# EasyEDA schematic SCH_pcb_tfg_v1.1a_conHDR_2021-07-26.json
TITLE: pcb_tfg_v1.1a_conHDR; REV: v1.1a; Date: 2021-04-10; Sheet: 1/1; Drawn By: Lucia Francoso
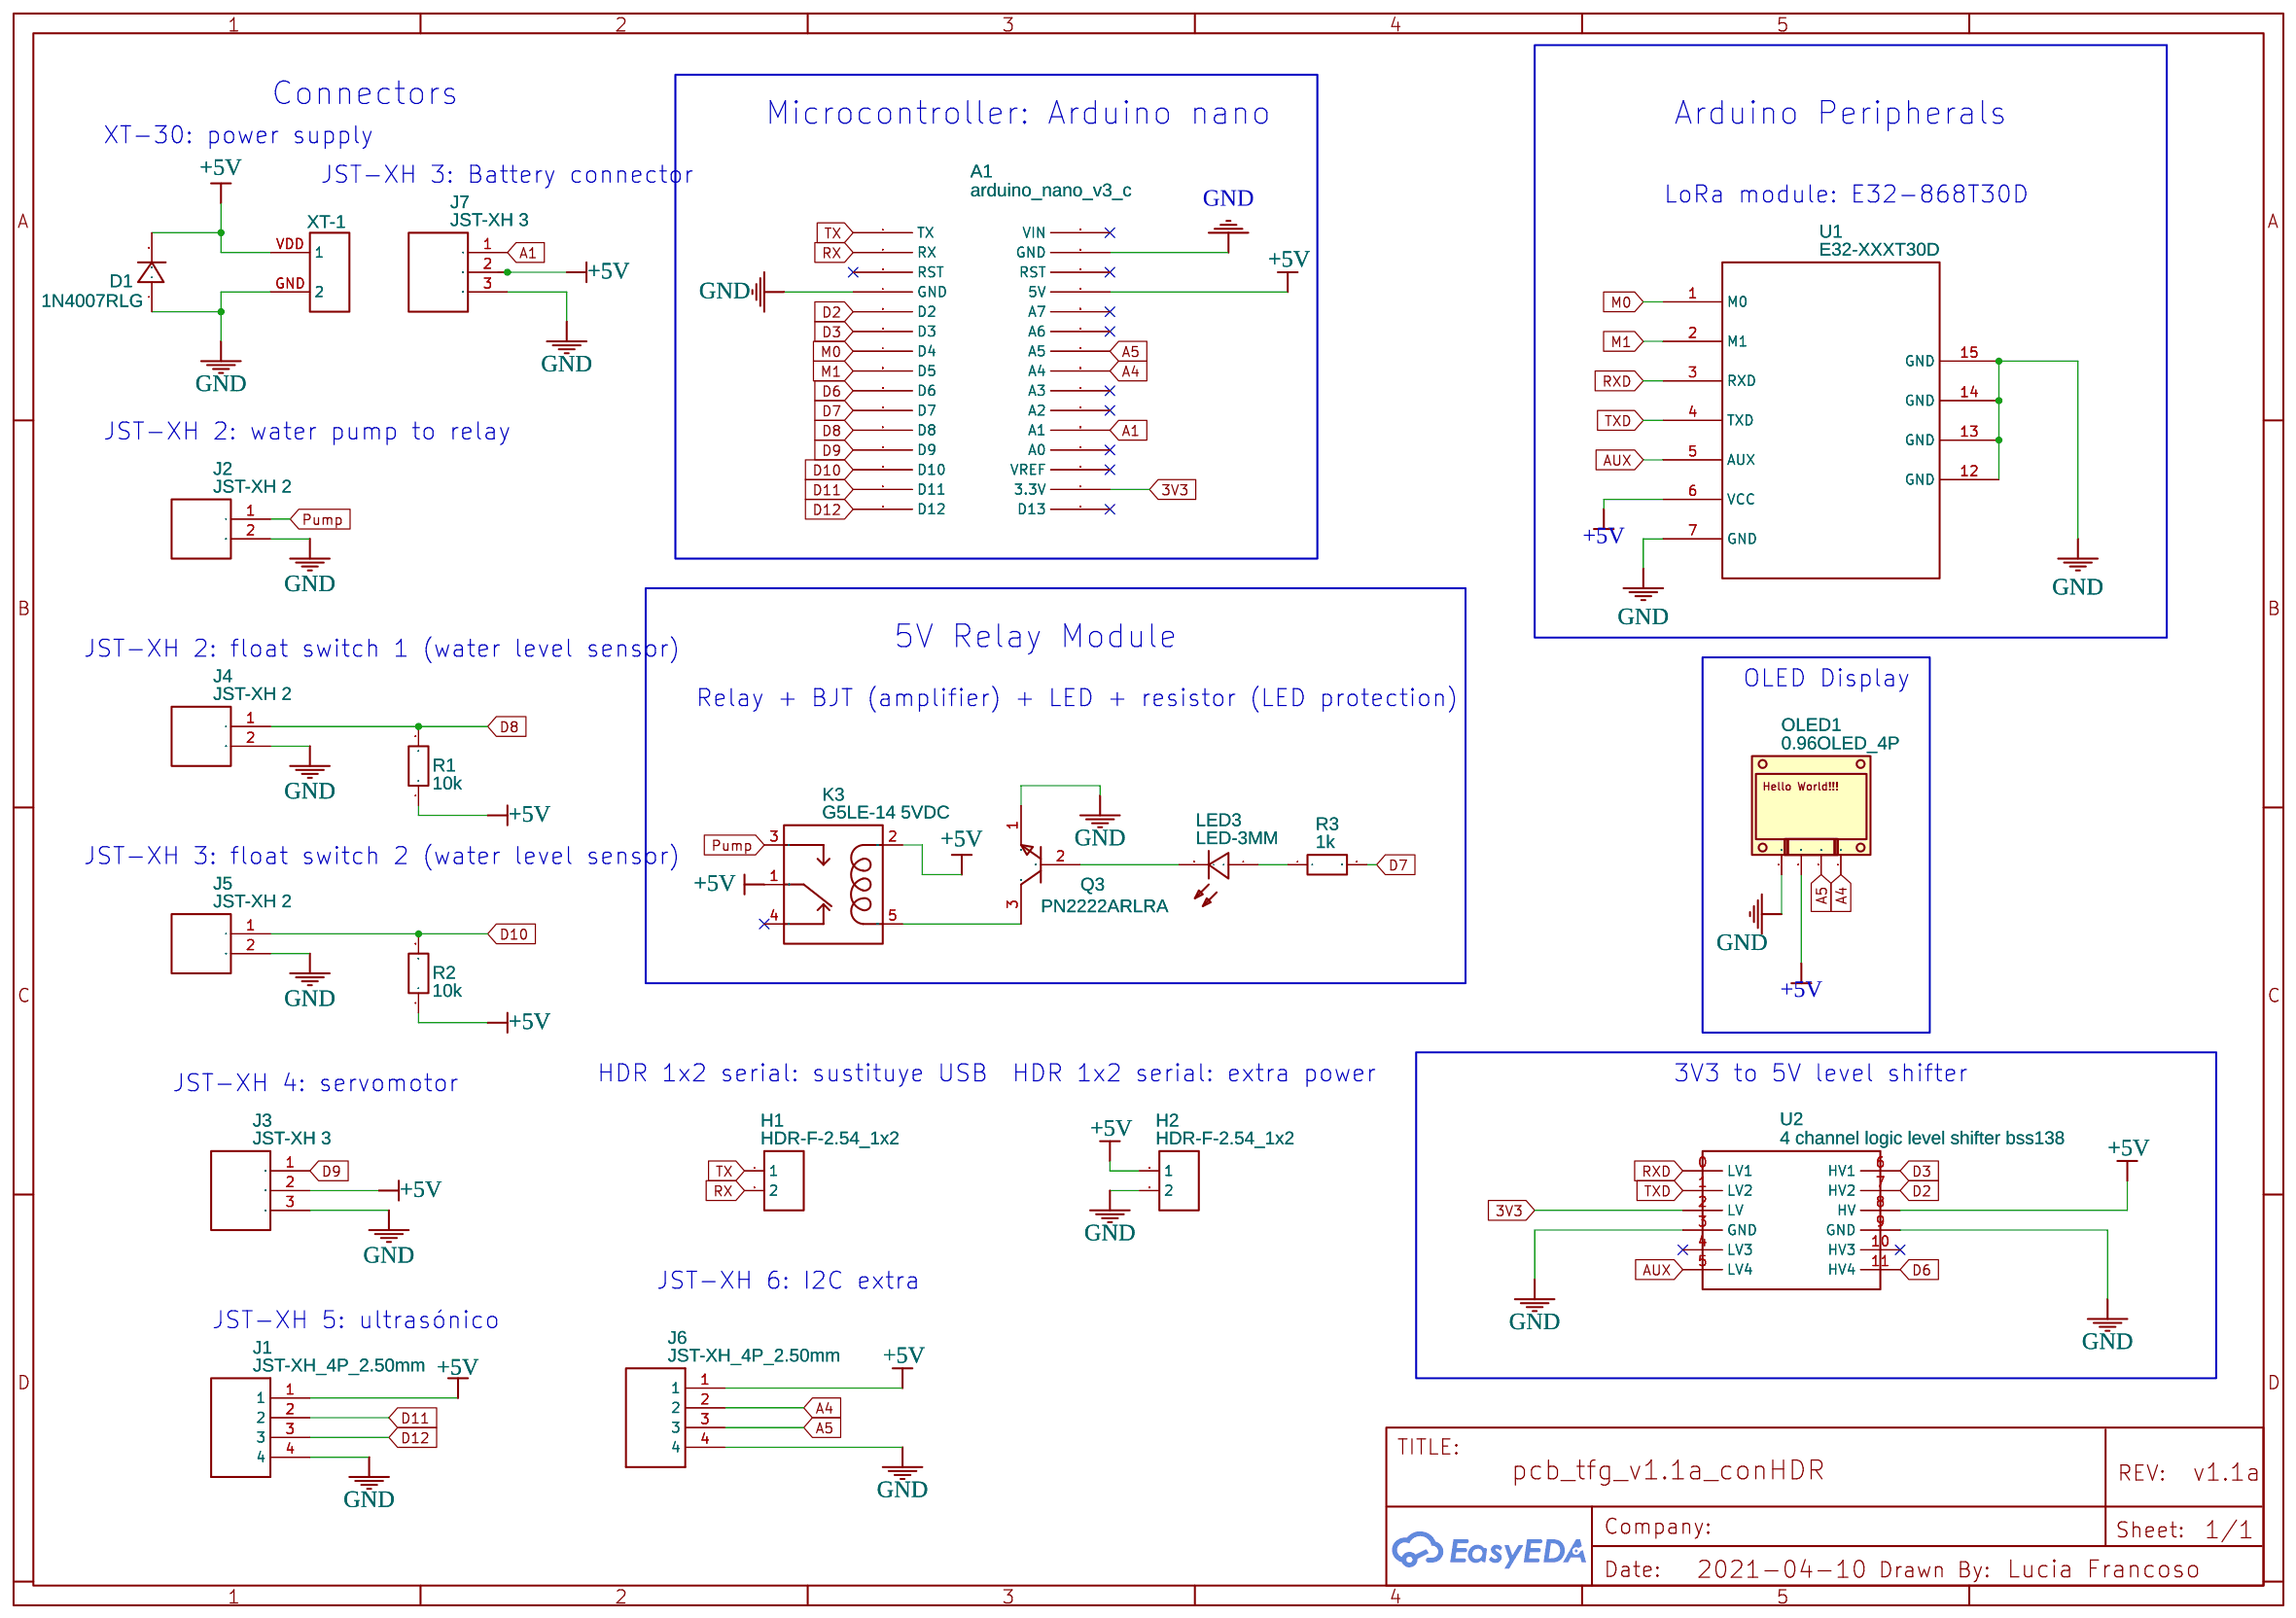
[diagram p0: schematic sheet]

## Parts
A1  arduino_nano_v3_с  [ARDUINO_NANO_С]
D1  1N4007RLG  [DO-41]
H1  HDR-F-2.54_1x2  [HDR-F-2.54_1X2]
H2  HDR-F-2.54_1x2  [HDR-F-2.54_1X2]
J1  JST-XH_4P_2.50mm  [JST-XH_4P]
J2  JST-XH 2  [JST-XH 2]
J3  JST-XH 3  [JST-XH 3-PIN]
J4  JST-XH 2  [JST-XH 2]
J5  JST-XH 2  [JST-XH 2]
J6  JST-XH_4P_2.50mm  [JST-XH_4P]
J7  JST-XH 3  [JST-XH 3-PIN]
K3  G5LE-14 5VDC  [RELAY-G5LE-14]
LED3  LED-3MM  [LED-3MM/2.54]
OLED1  0.96OLED_4P  [0.96OLED_4P]
Q3  PN2222ARLRA  [ONSC-TO-92-3-29-11_AM_BL]
R1  10k  [AXIAL-0.3]
R2  10k  [AXIAL-0.3]
R3  1k  [AXIAL-0.3]
U1  E32-XXXT30D  [E32-433T30D]
U2  4 channel logic level shifter bss138  [4 CHANNEL LOGIC LEVEL SHIFTER BSS138]
XT-1  Terminal_2P/5.08  [XT-30_PAD]

## Library data of the parts
A1 = arduino_nano_v3_с: Manufacturer Part: Arduino Nano; Contributor: Der_Meister1979
D1 = 1N4007RLG: Supplier: LCSC; Manufacturer: ON; image: //image.lceda.cn/szlcsc/C53568.jpg; Supplier Part: C53568
H1 H2 = HDR-F-2.54_1x2: Supplier Part: C49661; Supplier: LCSC; Contributor: LCEDA_Lib
J1 J6 = JST-XH_4P_2.50mm: Manufacturer Part: JST; Contributor: patrick.harrer94
J2 J4 J5 = JST-XH 2: Contributor: Chia Franfer; sourceId: TRL3lfxPJ
J3 J7 = JST-XH 3: Contributor: Chia Franfer; sourceId: TRL3lfxPJ; Supplier Part: 455-2248-ND; Supplier: Digi-Key; Manufacturer Part: B3B-XH-A(LF)(SN)
K3 = -: Supplier: LCSC; Supplier Part: C116963; Manufacturer: Omron Electronics; Contributor: LCSC
LED3 = -: Supplier: LCSC; Manufacturer: EVERLIGHT; Manufacturer Part: 204-10SURD/S530-A3; Supplier Part: C99772
OLED1 = 0.96OLED_4P: Supplier: LCSC; Contributor: LCEDA_Lib
Q3 = -: General Purpose Transistor, NPN Silicon, 3-Pin TO-92, Tape and Reel; Manufacturer Part: ?
R1-R3 = Res_AXIAL-0.3(1/8W)_EU: Manufacturer Part: ?
U1 = E32-XXXT30D: Manufacturer Part: E32-433T30D (TTL-1W); Contributor: Chia Franfer
U2 = 4 channel logic level shifter bss138: Contributor: ralph.v.montfort
XT-1 = Terminal_2P/5.08: Manufacturer Part: Screw terminal 2p; Contributor: march6323

## Nets
3V3: A1.17(3.3V) U2.2(LV)
+5V: A1.27(5V) D1.C H2.1 J1.1 J3.2 J6.1 J7.2 K3.1(MAIN) K3.2(COIL2) OLED1.2 R1.1 R2.1 U1.6(VCC) U2.8(HV) XT-1.VDD(1)
GND: A1.4(GND) A1.29(GND) D1.A H2.2 J1.4 J2.2 J3.3(2) J4.2 J5.2 J6.4 J7.3(2) OLED1.1 Q3.1(E) U1.7(GND) U1.12(GND) U1.13(GND) U1.14(GND) U1.15(GND) U2.3(GND) U2.9(GND) XT-1.GND(2)
A1: A1.20(A1) J7.1
A4: A1.23(A4) J6.2 OLED1.4
A5: A1.24(A5) J6.3 OLED1.3
AUX: U1.5(AUX) U2.5(LV4)
D2: A1.5(D2) U2.7(HV2)
D3: A1.6(D3) U2.6(HV1)
D6: A1.9(D6) U2.11(HV4)
D7: A1.10(D7) R3.2
D8: A1.11(D8) J4.1 R1.2
D9: A1.12(D9) J3.1
D10: A1.13(D10) J5.1 R2.2
D11: A1.14(D11) J1.2
D12: A1.15(D12) J1.3
M0: A1.7(D4) U1.1(M0)
M1: A1.8(D5) U1.2(M1)
Pump: J2.1 K3.3(NO)
RX: A1.2(RX) H1.2
RXD: U1.3(RXD) U2.0(LV1)
TX: A1.1(TX) H1.1
TXD: U1.4(TXD) U2.1(LV2)
Net-(K3-5): K3.5(COIL1) Q3.3(C)
Net-(LED3-1): LED3.1(+) R3.1
Net-(LED3-2): LED3.2(-) Q3.2(B)

Not connected (* = marked no-connect by the designer): A1 3(RST)* 16(D13)* 18(VREF)* 19(A0)* 21(A2)* 22(A3)* 25(A6)* 26(A7)* 28(RST)* 30(VIN)*; K3 4(NC)*; U2 4(LV3)* 10(HV3)*

## Notes on the sheet
- Connectors
- Microcontroller: Arduino nano
- Arduino Peripherals
- XT-30: power supply
- JST-XH 3: Battery connector
- LoRa module: E32-868T30D
- JST-XH 2: water pump to relay
- 5V Relay Module
- JST-XH 2: float switch 1 (water level sensor)
- OLED Display
- Relay + BJT (amplifier) + LED + resistor (LED protection)
- JST-XH 3: float switch 2 (water level sensor)
- JST-XH 4: servomotor
- HDR 1x2 serial: sustituye USB
- HDR 1x2 serial: extra power
- 3V3 to 5V level shifter
- JST-XH 6: I2C extra
- JST-XH 5: ultrasónico
